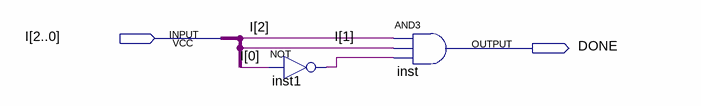
[diagram p0: schematic sheet]
// Quartus schematic DC.bdf as structural Verilog: 2 symbols, 2 pins
module DC (
  input  [2:0] I,
  output DONE
);

  wire inst1_out;

  not inst1 (inst1_out, I[0]);
  and inst (DONE, I[2], I[1], inst1_out);
endmodule
